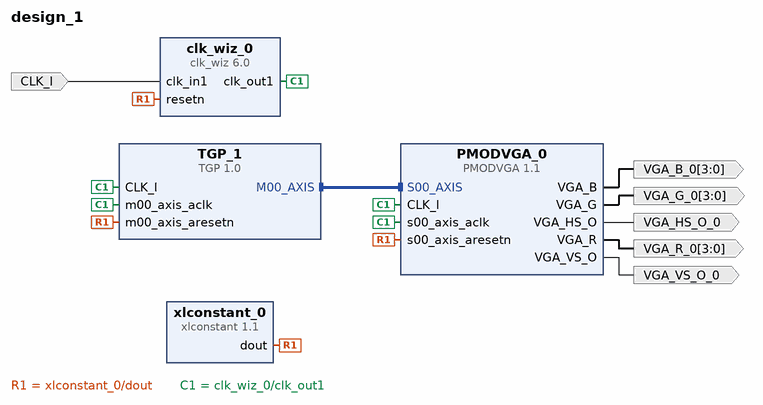
[diagram p0: block diagram of the top level]
# Vivado block design design_1, xc7z010clg400-1, Vivado 2020.2
create_bd_design design_1

create_bd_port -dir I CLK_I
create_bd_port -dir O -from 3 -to 0 VGA_R_0
create_bd_port -dir O -from 3 -to 0 VGA_B_0
create_bd_port -dir O VGA_VS_O_0
create_bd_port -dir O VGA_HS_O_0
create_bd_port -dir O -from 3 -to 0 VGA_G_0

create_bd_cell -type ip -vlnv xilinx.com:ip:clk_wiz:6.0 clk_wiz_0
set_property -dict [list \
  CONFIG.CLKIN1_JITTER_PS 80.0 \
  CONFIG.CLKOUT1_DRIVES BUFG \
  CONFIG.CLKOUT1_JITTER 345.102 \
  CONFIG.CLKOUT1_PHASE_ERROR 261.747 \
  CONFIG.CLKOUT1_REQUESTED_OUT_FREQ 25.000 \
  CONFIG.CLKOUT2_DRIVES BUFG \
  CONFIG.CLKOUT3_DRIVES BUFG \
  CONFIG.CLKOUT4_DRIVES BUFG \
  CONFIG.CLKOUT5_DRIVES BUFG \
  CONFIG.CLKOUT6_DRIVES BUFG \
  CONFIG.CLKOUT7_DRIVES BUFG \
  CONFIG.JITTER_SEL No_Jitter \
  CONFIG.MMCM_BANDWIDTH OPTIMIZED \
  CONFIG.MMCM_CLKFBOUT_MULT_F 33 \
  CONFIG.MMCM_CLKIN1_PERIOD 8.000 \
  CONFIG.MMCM_CLKIN2_PERIOD 10.0 \
  CONFIG.MMCM_CLKOUT0_DIVIDE_F 33 \
  CONFIG.MMCM_CLKOUT0_DUTY_CYCLE 0.500 \
  CONFIG.MMCM_COMPENSATION ZHOLD \
  CONFIG.MMCM_DIVCLK_DIVIDE 5 \
  CONFIG.PLL_CLKIN_PERIOD 8.000 \
  CONFIG.PRIMITIVE PLL \
  CONFIG.PRIM_IN_FREQ 125.000 \
  CONFIG.RESET_PORT resetn \
  CONFIG.RESET_TYPE ACTIVE_LOW \
  CONFIG.USE_LOCKED false \
  CONFIG.USE_MIN_POWER false \
  CONFIG.USE_POWER_DOWN false \
] [get_bd_cells clk_wiz_0]
create_bd_cell -type ip -vlnv xilinx.com:ip:xlconstant:1.1 xlconstant_0
create_bd_cell -type ip -vlnv xilinx.com:user:TGP:1.0 TGP_1
create_bd_cell -type ip -vlnv xilinx.com:user:PMODVGA:1.1 PMODVGA_0

# ---- connections ----

connect_bd_intf_net [get_bd_intf_pins TGP_1/M00_AXIS] [get_bd_intf_pins PMODVGA_0/S00_AXIS]
connect_bd_net [get_bd_pins PMODVGA_0/VGA_R] [get_bd_ports VGA_R_0]
connect_bd_net [get_bd_pins PMODVGA_0/VGA_B] [get_bd_ports VGA_B_0]
connect_bd_net [get_bd_pins PMODVGA_0/VGA_VS_O] [get_bd_ports VGA_VS_O_0]
connect_bd_net [get_bd_pins PMODVGA_0/VGA_HS_O] [get_bd_ports VGA_HS_O_0]
connect_bd_net [get_bd_pins PMODVGA_0/VGA_G] [get_bd_ports VGA_G_0]
connect_bd_net -net axis_aresetn_1 [get_bd_pins xlconstant_0/dout] \
  [get_bd_pins clk_wiz_0/resetn] [get_bd_pins TGP_1/m00_axis_aresetn] [get_bd_pins PMODVGA_0/s00_axis_aresetn]
connect_bd_net [get_bd_pins clk_wiz_0/clk_out1] \
  [get_bd_pins TGP_1/CLK_I] [get_bd_pins TGP_1/m00_axis_aclk] [get_bd_pins PMODVGA_0/CLK_I] \
  [get_bd_pins PMODVGA_0/s00_axis_aclk]
connect_bd_net [get_bd_ports CLK_I] [get_bd_pins clk_wiz_0/clk_in1]

validate_bd_design
save_bd_design
